# Altium schematic sheet MPBoard_L5_Sens1_2_ext.SchDoc
size A3; SheetNumber: 5; SheetTotal: 5
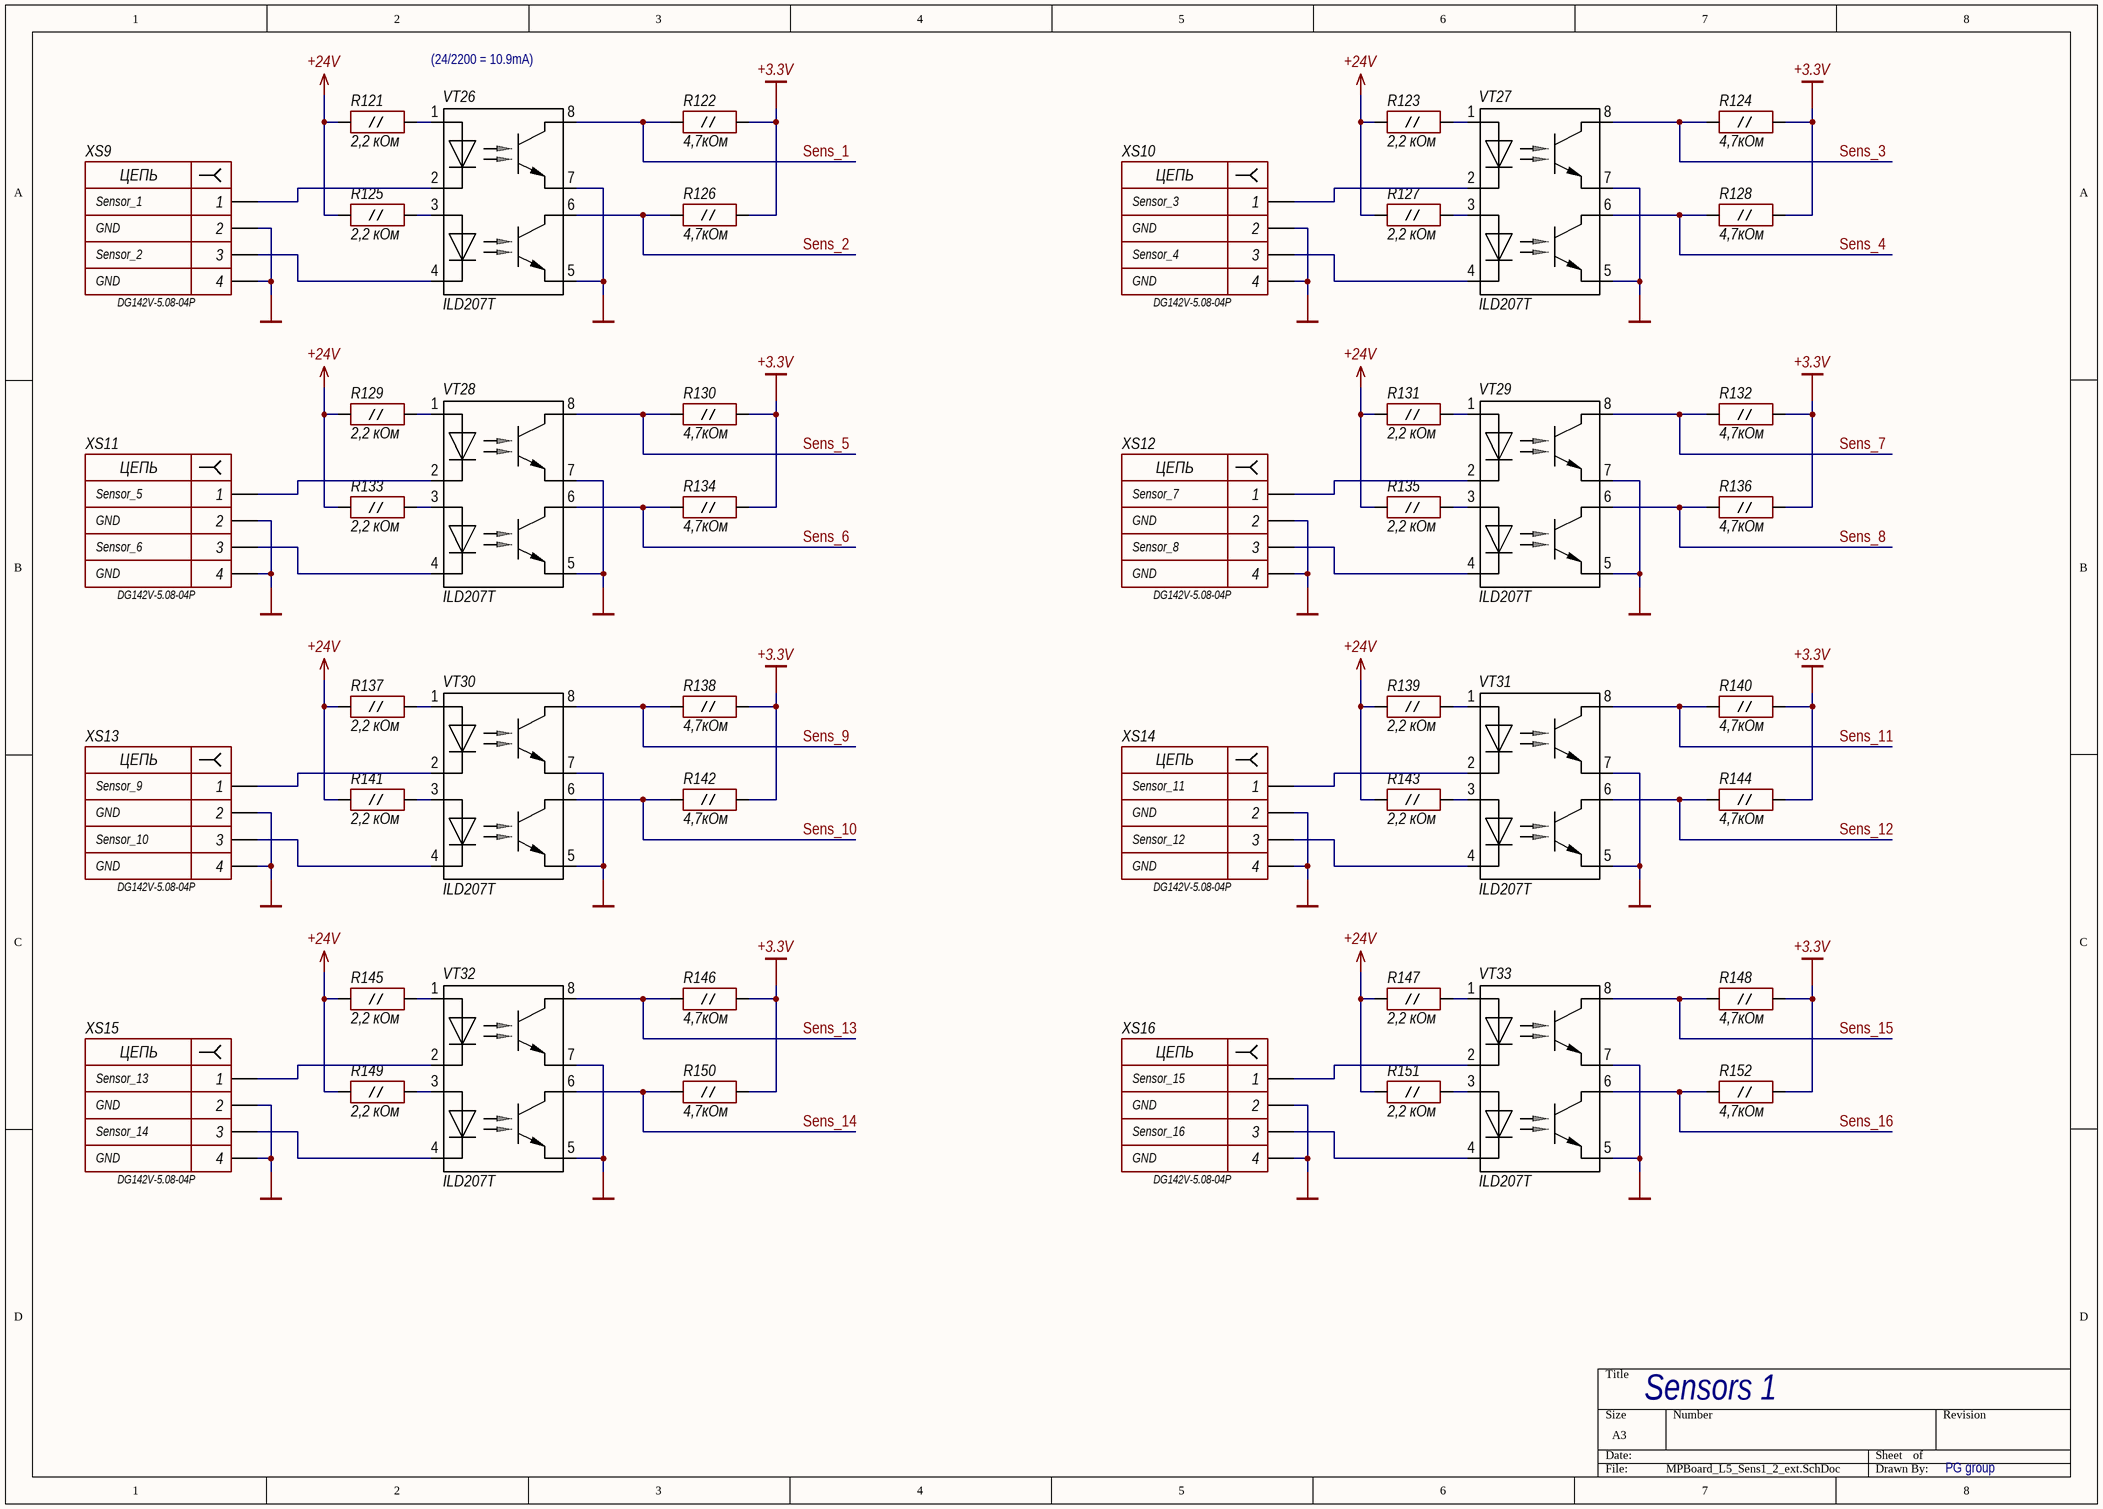
[diagram p0: MPBoard_L5_Sens1_2_ext.SchDoc]

## Parts
R121  2,2 кОм  [RES-0805]
R122  4,7кОм  [RES-0805]
R123  2,2 кОм  [RES-0805]
R124  4,7кОм  [RES-0805]
R125  2,2 кОм  [RES-0805]
R126  4,7кОм  [RES-0805]
R127  2,2 кОм  [RES-0805]
R128  4,7кОм  [RES-0805]
R129  2,2 кОм  [RES-0805]
R130  4,7кОм  [RES-0805]
R131  2,2 кОм  [RES-0805]
R132  4,7кОм  [RES-0805]
R133  2,2 кОм  [RES-0805]
R134  4,7кОм  [RES-0805]
R135  2,2 кОм  [RES-0805]
R136  4,7кОм  [RES-0805]
R137  2,2 кОм  [RES-0805]
R138  4,7кОм  [RES-0805]
R139  2,2 кОм  [RES-0805]
R140  4,7кОм  [RES-0805]
R141  2,2 кОм  [RES-0805]
R142  4,7кОм  [RES-0805]
R143  2,2 кОм  [RES-0805]
R144  4,7кОм  [RES-0805]
R145  2,2 кОм  [RES-0805]
R146  4,7кОм  [RES-0805]
R147  2,2 кОм  [RES-0805]
R148  4,7кОм  [RES-0805]
R149  2,2 кОм  [RES-0805]
R150  4,7кОм  [RES-0805]
R151  2,2 кОм  [RES-0805]
R152  4,7кОм  [RES-0805]
VT26  ILD207T  [SOIC-8]
VT27  ILD207T  [SOIC-8]
VT28  ILD207T  [SOIC-8]
VT29  ILD207T  [SOIC-8]
VT30  ILD207T  [SOIC-8]
VT31  ILD207T  [SOIC-8]
VT32  ILD207T  [SOIC-8]
VT33  ILD207T  [SOIC-8]
XS9  DG142V-5.08-04P  NET1: Sensor_1  NET2: GND  NET3: Sensor_2  [DG142V-5.08-04]
XS10  DG142V-5.08-04P  NET1: Sensor_3  NET2: GND  NET3: Sensor_4  [DG142V-5.08-04]
XS11  DG142V-5.08-04P  NET1: Sensor_5  NET2: GND  NET3: Sensor_6  [DG142V-5.08-04]
XS12  DG142V-5.08-04P  NET1: Sensor_7  NET2: GND  NET3: Sensor_8  [DG142V-5.08-04]
XS13  DG142V-5.08-04P  NET1: Sensor_9  NET2: GND  NET3: Sensor_10  [DG142V-5.08-04]
XS14  DG142V-5.08-04P  NET1: Sensor_11  NET2: GND  NET3: Sensor_12  [DG142V-5.08-04]
XS15  DG142V-5.08-04P  NET1: Sensor_13  NET2: GND  NET3: Sensor_14  [DG142V-5.08-04]
XS16  DG142V-5.08-04P  NET1: Sensor_15  NET2: GND  NET3: Sensor_16  [DG142V-5.08-04]

## Nets
+3.3V: R122.2 R124.2 R126.2 R128.2 R130.2 R132.2 R134.2 R136.2 R138.2 R140.2 R142.2 R144.2 R146.2 R148.2 R150.2 R152.2
+24V: R121.1 R123.1 R125.1 R127.1 R129.1 R131.1 R133.1 R135.1 R137.1 R139.1 R141.1 R143.1 R145.1 R147.1 R149.1 R151.1
GND: VT26.5 VT26.7 VT27.5 VT27.7 VT28.5 VT28.7 VT29.5 VT29.7 VT30.5 VT30.7 VT31.5 VT31.7 VT32.5 VT32.7 VT33.5 VT33.7 XS9.2 XS9.4 XS10.2 XS10.4 XS11.2 XS11.4 XS12.2 XS12.4 XS13.2 XS13.4 XS14.2 XS14.4 XS15.2 XS15.4 XS16.2 XS16.4
Sens_1: R122.1 VT26.8
Sens_2: R126.1 VT26.6
Sens_3: R124.1 VT27.8
Sens_4: R128.1 VT27.6
Sens_5: R130.1 VT28.8
Sens_6: R134.1 VT28.6
Sens_7: R132.1 VT29.8
Sens_8: R136.1 VT29.6
Sens_9: R138.1 VT30.8
Sens_10: R142.1 VT30.6
Sens_11: R140.1 VT31.8
Sens_12: R144.1 VT31.6
Sens_13: R146.1 VT32.8
Sens_14: R150.1 VT32.6
Sens_15: R148.1 VT33.8
Sens_16: R152.1 VT33.6
NetR121_2: R121.2 VT26.1
NetR123_2: R123.2 VT27.1
NetR125_2: R125.2 VT26.3
NetR127_2: R127.2 VT27.3
NetR129_2: R129.2 VT28.1
NetR131_2: R131.2 VT29.1
NetR133_2: R133.2 VT28.3
NetR135_2: R135.2 VT29.3
NetR137_2: R137.2 VT30.1
NetR139_2: R139.2 VT31.1
NetR141_2: R141.2 VT30.3
NetR143_2: R143.2 VT31.3
NetR145_2: R145.2 VT32.1
NetR147_2: R147.2 VT33.1
NetR149_2: R149.2 VT32.3
NetR151_2: R151.2 VT33.3
NetVT26_2: VT26.2 XS9.1
NetVT26_4: VT26.4 XS9.3
NetVT27_2: VT27.2 XS10.1
NetVT27_4: VT27.4 XS10.3
NetVT28_2: VT28.2 XS11.1
NetVT28_4: VT28.4 XS11.3
NetVT29_2: VT29.2 XS12.1
NetVT29_4: VT29.4 XS12.3
NetVT30_2: VT30.2 XS13.1
NetVT30_4: VT30.4 XS13.3
NetVT31_2: VT31.2 XS14.1
NetVT31_4: VT31.4 XS14.3
NetVT32_2: VT32.2 XS15.1
NetVT32_4: VT32.4 XS15.3
NetVT33_2: VT33.2 XS16.1
NetVT33_4: VT33.4 XS16.3

## Notes on the sheet
- (24/2200 = 10.9mA)
- Sensors 1
- PG group
- (in symbol XS4) ЦЕПЬ

## Library data of the parts
R121 R123 R125 R127 R129 R131 R133 R135 R137 R139 R141 R143 R145 R147 R149 R151 = R_0.125W: Резистор 0.125 W; Manufacturer: Vishay; ManufacturerPartNumber: CRCW080513K3FKEA; Tolerance: ± 1 %; ValueDescription: Резистор 2,2 кОм ± 1 % SMD 0805; Package: SMD 0805; Value: 2,2 кОм; HelpURL: https://www.vishay.com/docs/20035/dcrcwe3.pdf; IPSPartNumber: *; NameRUS: Резистор
R122 R124 R126 R128 R130 R132 R134 R136 R138 R140 R142 R144 R146 R148 R150 R152 = R_0.125W: Резистор 0.125 W; Manufacturer: Vishay; ManufacturerPartNumber: CRCW080513K3FKEA; Tolerance: ± 1 %; ValueDescription: Резистор 4,7кОм ± 1 % SMD 0805; Package: SMD 0805; Value: 4,7кОм; HelpURL: https://www.vishay.com/docs/20035/dcrcwe3.pdf; IPSPartNumber: *; NameRUS: Резистор
VT26-VT33 = VT_2xOPTOCOUPLER: Оптопара; Manufacturer: Vishay; ManufacturerPartNumber: ILD207T; Package: SOIC-8; HelpURL: https://www.chipdip.by/product/ild207-t
XS9-XS16 = XS4: Розетка 4 контакта; Manufacturer: Degson Electronics; ManufacturerPartNumber: DG142V-5.08-04P-14-00AH; Value: DG142V-5.08-04P; HelpURL: https://www.chipdip.ru/product0/8499084156; NET4: GND